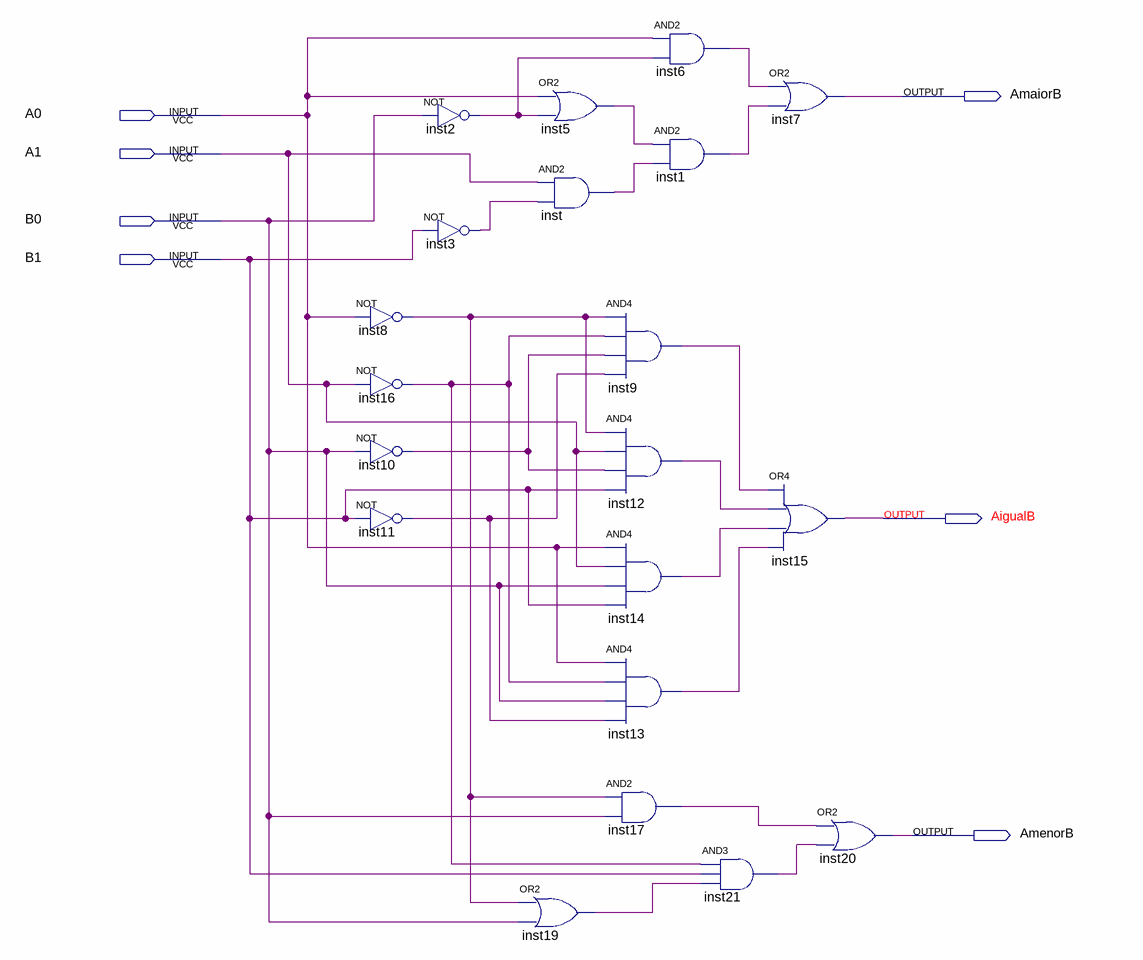
[diagram p0: schematic sheet]
// Quartus schematic AtividadeAvaliada.bdf as structural Verilog: 20 symbols, 7 pins
module AtividadeAvaliada (
  input  A0,
  input  A1,
  input  B0,
  input  B1,
  output AmaiorB,
  output AigualB,
  output AmenorB
);

  wire inst1_out, inst2_out, inst3_out, inst5_out, inst6_out, inst8_out, inst9_out, inst10_out, inst11_out,
       inst12_out, inst13_out, inst14_out, inst16_out, inst17_out, inst19_out, inst21_out, inst_out;

  not inst8 (inst8_out, A0);
  not inst16 (inst16_out, A1);
  not inst10 (inst10_out, B0);
  not inst11 (inst11_out, B1);
  not inst2 (inst2_out, B0);
  not inst3 (inst3_out, B1);
  or inst19 (inst19_out, inst8_out, B0);
  or inst5 (inst5_out, A0, inst2_out);
  and inst (inst_out, A1, inst3_out);
  and inst6 (inst6_out, A0, inst2_out);
  and inst1 (inst1_out, inst5_out, inst_out);
  and inst9 (inst9_out, inst8_out, inst16_out, inst10_out, inst11_out);
  and inst12 (inst12_out, inst8_out, A1, inst10_out, B1);
  and inst14 (inst14_out, A0, A1, B0, B1);
  and inst13 (inst13_out, A0, inst16_out, B0, inst11_out);
  and inst17 (inst17_out, inst8_out, B0);
  and inst21 (inst21_out, inst16_out, B1, inst19_out);
  or inst7 (AmaiorB, inst6_out, inst1_out);
  or inst15 (AigualB, inst9_out, inst12_out, inst14_out, inst13_out);
  or inst20 (AmenorB, inst17_out, inst21_out);
endmodule
